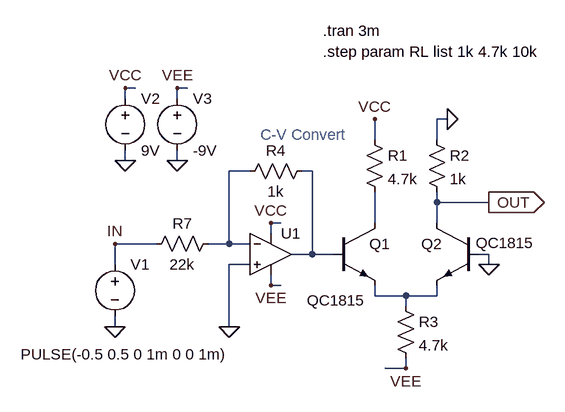
[diagram p0: schematic LadderFilter_CurrentSource_Tragi_2SC1815.asc]
LadderFilter_CurrentSource_Tragi_2SC1815.asc, the LTspice schematic file:
Version 4
SHEET 1 1028 748
WIRE 208 48 192 48
WIRE 288 48 272 48
WIRE 192 64 192 48
WIRE 272 64 272 48
WIRE 688 96 672 96
WIRE 576 128 576 96
WIRE 672 128 672 96
WIRE 192 160 192 144
WIRE 272 160 272 144
WIRE 384 176 352 176
WIRE 480 176 464 176
WIRE 672 224 672 208
WIRE 752 224 672 224
WIRE 432 256 416 256
WIRE 576 256 576 208
WIRE 672 256 672 224
WIRE 416 272 416 256
WIRE 240 288 176 288
WIRE 352 288 352 176
WIRE 352 288 320 288
WIRE 384 288 352 288
WIRE 480 304 480 176
WIRE 480 304 448 304
WIRE 512 304 480 304
WIRE 752 304 736 304
WIRE 176 320 176 288
WIRE 384 320 352 320
WIRE 752 320 752 304
WIRE 416 352 416 336
WIRE 432 352 416 352
WIRE 576 368 576 352
WIRE 624 368 576 368
WIRE 672 368 672 352
WIRE 672 368 624 368
WIRE 624 384 624 368
WIRE 176 416 176 400
WIRE 352 416 352 320
WIRE 624 480 624 464
WIRE 624 480 592 480
FLAG 752 320 0
FLAG 576 96 VCC
FLAG 176 416 0
FLAG 192 160 0
FLAG 272 160 0
FLAG 192 48 VCC
FLAG 272 48 VEE
FLAG 176 288 IN
FLAG 752 224 OUT
IOPIN 752 224 Out
FLAG 624 480 VEE
FLAG 416 256 VCC
FLAG 416 352 VEE
FLAG 352 416 0
FLAG 688 96 0
SYMBOL npn 512 256 R0
WINDOW 3 -40 119 Left 2
SYMATTR Value QC1815
SYMATTR InstName Q1
SYMBOL npn 736 256 M0
WINDOW 3 -86 31 Left 2
SYMATTR Value QC1815
SYMATTR InstName Q2
SYMBOL res 560 112 R0
SYMATTR InstName R1
SYMATTR Value 4.7k
SYMBOL res 656 112 R0
SYMATTR InstName R2
SYMATTR Value 1k
SYMBOL res 608 368 R0
SYMATTR InstName R3
SYMATTR Value 4.7k
SYMBOL res 368 192 R270
WINDOW 0 32 56 VTop 2
WINDOW 3 0 56 VBottom 2
SYMATTR InstName R4
SYMATTR Value 1k
SYMBOL voltage 176 304 R0
WINDOW 3 -145 154 Left 2
WINDOW 123 0 0 Left 2
WINDOW 39 0 0 Left 2
SYMATTR Value PULSE(-0.5 0.5 0 1m 0 0 1m)
SYMATTR InstName V1
SYMBOL voltage 192 48 R0
WINDOW 123 0 0 Left 2
WINDOW 39 0 0 Left 2
SYMATTR InstName V2
SYMATTR Value 9V
SYMBOL voltage 272 48 R0
WINDOW 123 0 0 Left 2
WINDOW 39 0 0 Left 2
SYMATTR InstName V3
SYMATTR Value -9V
SYMBOL res 224 304 R270
WINDOW 0 32 56 VTop 2
WINDOW 3 0 56 VBottom 2
SYMATTR InstName R7
SYMATTR Value 22k
SYMBOL Opamps\\UniversalOpamp2 416 304 R0
SYMATTR InstName U1
TEXT 496 -40 Left 2 !.tran 3m
TEXT 496 -8 Left 2 !.step param RL list 1k 4.7k 10k
TEXT 400 120 Left 2 ;C-V Convert

The netlist it stands for:
* LadderFilter_CurrentSource_Tragi_2SC1815.asc
Q1 N003 N002 N004 0 QC1815
Q2 OUT 0 N004 0 QC1815
R1 VCC N003 4.7k
R2 0 OUT 1k
R3 N004 VEE 4.7k
R4 N001 N002 1k
V1 IN 0 PULSE(-0.5 0.5 0 1m 0 0 1m)
V2 VCC 0 9V
V3 VEE 0 -9V
R7 IN N001 22k
XU1 0 N001 VCC VEE N002 level.2 Avol=1Meg GBW=10Meg Slew=10Meg ilimit=25m rail=0 Vos=0 phimargin=45 en=0 enk=0 in=0 ink=0 Rin=500Meg  ; pins IN+ IN- V+ V- OUT
.model NPN NPN
.model PNP PNP
.lib standard.bjt
.tran 3m
.step param RL list 1k 4.7k 10k
* C-V Convert
.lib UniversalOpamps2.sub
.backanno
.end